# Altium schematic sheet ST_LINK_V3E.SchDoc: STLINK_V3E
size A3; Date: Not used; ApprovedBy: Not used; CheckedBy: Not used; Author: Not used; CompanyName: STMicroelectronics; DrawnBy: Not used; Engineer: Not used; Organization: Not used; Address1: Not used; Address2: Not used; Address3: Not used; Address4: Not used; DocumentNumber: 7; Revision: Not used; SheetNumber: 7; SheetTotal: 8; CurrentTime: Not used; CurrentDate: Not used; Time: Not used; DocumentFullPathAndName: Not used; DocumentName: Not used; ModifiedDate: Not used; ImagePath: Not used; ProjectName: Not used; Application_BuildNumber: Not used
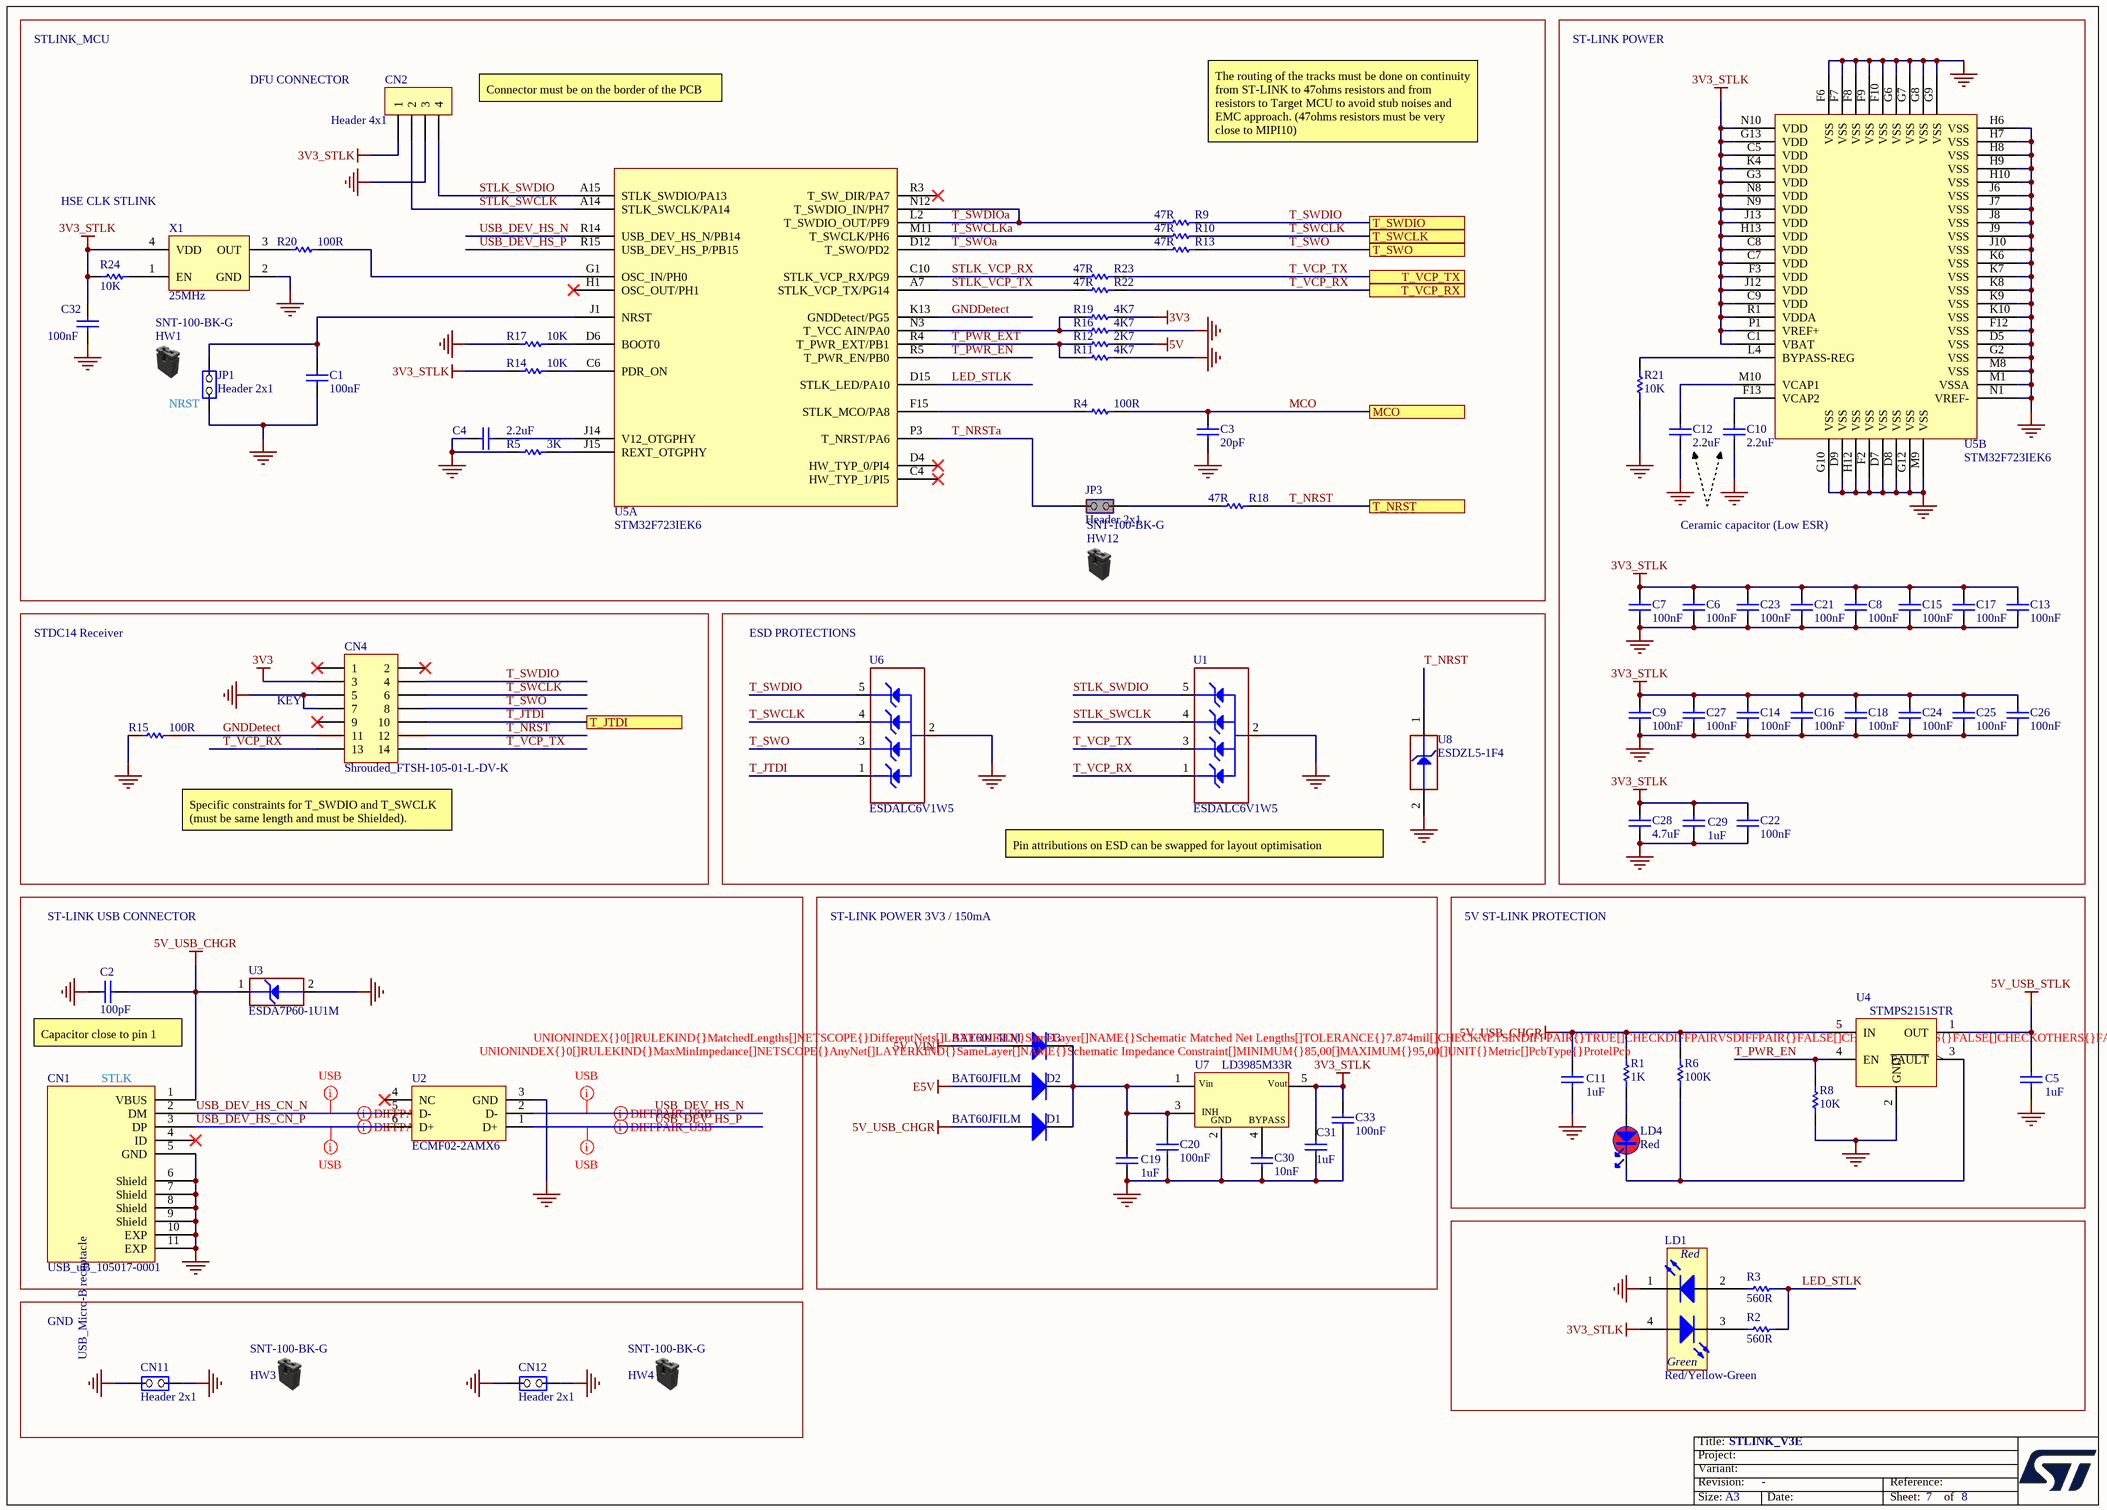
[diagram p0: ST_LINK_V3E.SchDoc]

## Parts
C1  value 100nF  [C0402]  (hidden comment: Capacitor)
C2  value 100pF  [C0402]
C3  value 20pF  [C0402]
C4  value 2.2uF  [C0603]
C5  value 1uF  [C0603]
C6  value 100nF  [C0402]  (hidden comment: Capacitor)
C7  value 100nF  [C0402]  (hidden comment: Capacitor)
C8  value 100nF  [C0402]  (hidden comment: Capacitor)
C9  value 100nF  [C0402]  (hidden comment: Capacitor)
C10  value 2.2uF  [C1206_H1P15]
C11  value 1uF  [C0603]
C12  value 2.2uF  [C1206_H1P15]
C13  value 100nF  [C0402]  (hidden comment: Capacitor)
C14  value 100nF  [C0402]  (hidden comment: Capacitor)
C15  value 100nF  [C0402]  (hidden comment: Capacitor)
C16  value 100nF  [C0402]  (hidden comment: Capacitor)
C17  value 100nF  [C0402]  (hidden comment: Capacitor)
C18  value 100nF  [C0402]  (hidden comment: Capacitor)
C19  value 1uF  [C0603]
C20  value 100nF  [C0402]  (hidden comment: Capacitor)
C21  value 100nF  [C0402]  (hidden comment: Capacitor)
C22  value 100nF  [C0402]  (hidden comment: Capacitor)
C23  value 100nF  [C0402]  (hidden comment: Capacitor)
C24  value 100nF  [C0402]  (hidden comment: Capacitor)
C25  value 100nF  [C0402]  (hidden comment: Capacitor)
C26  value 100nF  [C0402]  (hidden comment: Capacitor)
C27  value 100nF  [C0402]  (hidden comment: Capacitor)
C28  value 4.7uF  [C0603]
C29  value 1uF  [C0603]
C30  value 10nF  [C0402]
C31  value 1uF  [C0603]
C32  value 100nF  [C0402]  (hidden comment: Capacitor)
C33  value 100nF  [C0402]  (hidden comment: Capacitor)
CN1  value USB_uB_105017-0001  [CON_USBMICROB_MOLEX_105017-0001_H2P90]
CN2  value Header 4x1  [CON_SAMTEC_TSW-104-07-G-S]
CN4  value Shrouded_FTSH-105-01-L-DV-K  [CON_STDC14_Receiver_MEDIUM_WITH_MIPI10_3D]
CN11  value Header 2x1  [CON_SAMTEC_TSW-102-09-X-S]
CN12  value Header 2x1  [CON_SAMTEC_TSW-102-09-X-S]
D1  value BAT60JFILM  [DIO_SOD323]
D2  value BAT60JFILM  [DIO_SOD323]
D3  value BAT60JFILM  [DIO_SOD323]
HW1  value SNT-100-BK-G  (mechanical)
HW3  value SNT-100-BK-G  (mechanical)
HW4  value SNT-100-BK-G  (mechanical)
HW12  value SNT-100-BK-G  (mechanical)
JP1  value Header 2x1  [CON_SAMTEC_TSW-102-07-G-S]
JP3  value Header 2x1  [CON_SAMTEC_TSW-102-07-G-S]  (hidden comment: Shunt Fitted)
LD1  value Red/Yellow-Green  [LED_BI-GR_HSMF-A201-A00J1]  (hidden comment: LD_BICOLOR_CMS)
LD4  value Red  [LED_0603_VISHAY_VLMS1300-GS08_RED_1A2K_H0P8]  (hidden comment: LED_red)
R1  value 1K  [R0603]
R2  value 560R  [R0603]  (hidden comment: Resistor)
R3  value 560R  [R0603]  (hidden comment: Resistor)
R4  value 100R  [R0402]  (hidden comment: Resistor)
R5  value 3K  [R0402]
R6  value 100K  [R0603]
R8  value 10K  [R0603]
R9  value 47R  [R0402]
R10  value 47R  [R0402]
R11  value 4K7  [R0402]
R12  value 2K7  [R0402]
R13  value 47R  [R0402]
R14  value 10K  [R0402]
R15  value 100R  [R0402]  (hidden comment: Resistor)
R16  value 4K7  [R0402]
R17  value 10K  [R0402]
R18  value 47R  [R0402]
R19  value 4K7  [R0402]
R20  value 100R  [R0402]  (hidden comment: Resistor)
R21  value 10K  [R0402]
R22  value 47R  [R0402]
R23  value 47R  [R0402]
R24  value 10K  [R0402]
U1  value ESDALC6V1W5  [ESD_SOT323-5L]
U2  value ECMF02-2AMX6  [ESD_QFN-6L_1P7X1P5_P050]  (hidden comment: ​)
U3  value ESDA7P60-1U1M  [ESD_QFN2_1P6X1_P125]
U4  value STMPS2151STR  [MOS_SOT23-5L]
U5  value STM32F723IEK6  [ICC_UFBGA201_176+25_10X10_P065]  (parts A,B of 2)
U6  value ESDALC6V1W5  [ESD_SOT323-5L]
U7  value LD3985M33R  [REG_SOT23-5L]
U8  value ESDZL5-1F4  [ESD_0201_H0P3_1K_2A]  (hidden comment: ESD-TRANSIL)
X1  value 25MHz  [OSC_NDK_NZ2520SB_4P]

## Blocks framed on the sheet
ESD PROTECTIONS: U1 U6 U8
ST-LINK POWER 3V3 / 150mA: C19 C20 C30 C31 C33 D1-D3 U7
5V ST-LINK PROTECTION: C5 C11 LD4 R1 R6 R8 U4
GND: CN11 CN12 HW3 HW4

## Ports
MCO, T_JTDI, T_NRST, T_SWCLK, T_SWDIO, T_SWO, T_VCP_RX, T_VCP_TX

## Nets
3V3: CN4.3 R19.2
3V3_STLK: C6.2 C7.2 C8.2 C9.2 C13.2 C14.2 C15.2 C16.2 C17.2 C18.2 C21.2 C22.2 C23.2 C24.2 C25.2 C26.2 C27.2 C28.2 C29.2 C31.2 C32.2 C33.2 CN2.1 LD1.4(YellowGreen_anode) R14.1 R24.1 U5.C1(VBAT) U5.C5(VDD) U5.C7(VDD) U5.C8(VDD) U5.C9(VDD) U5.F3(VDD) U5.G3(VDD) U5.G13(VDD) U5.H13(VDD) U5.J12(VDD) U5.J13(VDD) U5.K4(VDD) U5.N8(VDD) U5.N9(VDD) U5.N10(VDD) U5.P1(VREF+) U5.R1(VDDA) U7.5(Vout) X1.4(VDD)
5V: R12.1
5V_USB_CHGR: C2.2 C11.2 CN1.1(VBUS) D1.1(A) R1.2 R6.2 U3.1(IO1) U4.5(IN)
5V_USB_STLK: C5.2 U4.1(OUT)
5V_VIN: D3.1(A)
E5V: D2.1(A)
GND: C1.1 C2.1 C3.1 C4.1 C5.1 C6.1 C7.1 C8.1 C9.1 C10.1 C11.1 C12.1 C13.1 C14.1 C15.1 C16.1 C17.1 C18.1 C19.1 C20.1 C21.1 C22.1 C23.1 C24.1 C25.1 C26.1 C27.1 C28.1 C29.1 C30.1 C31.1 C32.1 C33.1 CN1.5(GND) CN1.6(Shield) CN1.7(Shield) CN1.8(Shield) CN1.9(Shield) CN1.10(EXP) CN1.11(EXP) CN2.3 CN4.5 CN4.7 CN11.1(COMMON) CN11.2(NO) CN12.1(COMMON) CN12.2(NO) JP1.1(COMMON) LD1.1(RED_cathode) R5.1 R8.2 R11.1 R15.1 R16.2 R17.1 R21.1 U1.2(GND) U2.3(GND) U3.2(GND) U4.2(GND) U5.D5(VSS) U5.D7(VSS) U5.D8(VSS) U5.D9(VSS) U5.F2(VSS) U5.F6(VSS) U5.F7(VSS) U5.F8(VSS) U5.F9(VSS) U5.F10(VSS) U5.F12(VSS) U5.G2(VSS) U5.G6(VSS) U5.G7(VSS) U5.G8(VSS) U5.G9(VSS) U5.G10(VSS) U5.G12(VSS) U5.H6(VSS) U5.H7(VSS) U5.H8(VSS) U5.H9(VSS) U5.H10(VSS) U5.H12(VSS) U5.J6(VSS) U5.J7(VSS) U5.J8(VSS) U5.J9(VSS) U5.J10(VSS) U5.K6(VSS) U5.K7(VSS) U5.K8(VSS) U5.K9(VSS) U5.K10(VSS) U5.M1(VSSA) U5.M8(VSS) U5.M9(VSS) U5.N1(VREF-) U6.2(GND) U7.2(GND) U8.2(GND) X1.2(GND)
GNDDetect: CN4.11 R15.2 U5.K13(GNDDetect/PG5)
LED_STLK: R2.2 R3.2 U5.D15(STLK_LED/PA10)
MCO: C3.2 R4.2 ; port MCO
STLK_SWCLK: CN2.2 U1.4(IO3) U5.A14(STLK_SWCLK/PA14)
STLK_SWDIO: CN2.4 U1.5(IO4) U5.A15(STLK_SWDIO/PA13)
STLK_VCP_RX: R23.1 U5.C10(STLK_VCP_RX/PG9)
STLK_VCP_TX: R22.1 U5.A7(STLK_VCP_TX/PG14)
T_JTDI: CN4.10 U6.1(IO1) ; port T_JTDI
T_NRST: CN4.12 R18.2 U8.1(IO1) ; port T_NRST
T_NRSTa: JP3.1(COMMON) U5.P3(T_NRST/PA6)
T_PWR_EN: R8.1 U4.4(EN) U5.R5(T_PWR_EN/PB0)
T_PWR_EXT: R11.2 R12.2 U5.R4(T_PWR_EXT/PB1)
T_SWCLK: CN4.6 R10.2 U6.4(IO3) ; port T_SWCLK
T_SWCLKa: R10.1 U5.M11(T_SWCLK/PH6)
T_SWDIO: CN4.4 R9.2 U6.5(IO4) ; port T_SWDIO
T_SWDIOa: R9.1 U5.L2(T_SWDIO_OUT/PF9) U5.N12(T_SWDIO_IN/PH7)
T_SWO: CN4.8 R13.2 U6.3(IO2) ; port T_SWO
T_SWOa: R13.1 U5.D12(T_SWO/PD2)
T_VCP_RX: CN4.13 R22.2 U1.1(IO1) ; port T_VCP_RX
T_VCP_TX: CN4.14 R23.2 U1.3(IO2) ; port T_VCP_TX
USB_DEV_HS_CN_N: CN1.2(DM) U2.5(D-)
USB_DEV_HS_CN_P: CN1.3(DP) U2.6(D+)
USB_DEV_HS_N: U2.2(D-) U5.R14(USB_DEV_HS_N/PB14)
USB_DEV_HS_P: U2.1(D+) U5.R15(USB_DEV_HS_P/PB15)
NetC1_2: C1.2 JP1.2(NO) U5.J1(NRST)
NetC4_2: C4.2 U5.J14(V12_OTGPHY)
NetC10_2: C10.2 U5.F13(VCAP2)
NetC12_2: C12.2 U5.M10(VCAP1)
NetC19_2: C19.2 C20.2 D1.2(K) D2.2(K) D3.2(K) U7.1(Vin) U7.3(CE)
NetC30_2: C30.2 U7.4(BYPASS)
NetJP3_2: JP3.2(NO) R18.1
NetLD1_2: LD1.2(Red_anode) R3.1
NetLD1_3: LD1.3(YellowGreen_cathode) R2.1
NetLD4_1: LD4.1 R1.1
NetLD4_2: LD4.2 R6.1 U4.3(~{FAULT})
NetR4_1: R4.1 U5.F15(STLK_MCO/PA8)
NetR5_2: R5.2 U5.J15(REXT_OTGPHY)
NetR14_2: R14.2 U5.C6(PDR_ON)
NetR16_1: R16.1 R19.1 U5.N3(T_VCC_AIN/PA0)
NetR17_2: R17.2 U5.D6(BOOT0)
NetR20_1: R20.1 X1.3(OUT)
NetR20_2: R20.2 U5.G1(OSC_IN/PH0)
NetR21_2: R21.2 U5.L4(BYPASS-REG)
NetR24_2: R24.2 X1.1(EN)

Not connected (* = marked no-connect by the designer): CN1 4(ID)*; CN4 1* 2* 9*; U2 4(NC)*; U5 C4(HW_TYP_1/PI5)* D4(HW_TYP_0/PI4)* H1(OSC_OUT/PH1)* R3(T_SW_DIR/PA7)*

## Layout directives
differential pair; rule Impedance Constraint [Min = 85.00    Max = 95.00    ]: USB_DEV_HS_CN_N, USB_DEV_HS_CN_P, USB_DEV_HS_N, USB_DEV_HS_P
rule Undefined; rule Matched Net Lengths [Tolerance = 0.2mm]; rule Impedance Constraint [Min = 85.00    Max = 95.00    ]: USB_DEV_HS_CN_N, USB_DEV_HS_CN_P, USB_DEV_HS_N, USB_DEV_HS_P

## Notes on the sheet
- STLINK_MCU
- ST-LINK POWER
- DFU CONNECTOR
- (near CN2) Connector must be on the border of the PCB
- The routing of the tracks must be done on continuity from ST-LINK to 47ohms resistors and from resistors to Target MCU to avoid stub noises and EMC approach. (47ohms resistors must be very close to MIPI10)
- HSE CLK STLINK
- (near JP1) NRST
- Ceramic capacitor (Low ESR)
- STDC14 Receiver
- (near CN4) KEY
- Specific constraints for T_SWDIO and T_SWCLK (must be same length and must be Shielded).
- Pin attributions on ESD can be swapped for layout optimisation
- ST-LINK USB CONNECTOR
- (near C2) Capacitor close to pin 1
- (near CN1) STLK
- Title:
- Project:
- Size:
- Revision:
- Variant:
- A3
- -
- Date:
- Reference:
- Sheet:
- of
- (in symbol MCD-00028) USB_Micro-B receptacle
- (in symbol MCD-00086) INH
- (in symbol MCD-02402) Red; Green

## Library data of the parts
C1 C6-C9 C13-C18 C20-C27 C32 C33 = MCD-00006: Capacitor, MLCC, 100nF, 16V, X7R, +/-10%, 0402, T=0.5mm; Manufacturer_Part_Number: CC0402KRX7R7BB104; Manufacturer: YAGEO; Part_Preference: Recommended; Partial_Alternate_Internal_Part_Number: MCD-03299; Order_Code_RS: 9402047; Component_Country_Of_Origin: China; ShowFields: YES; ID: 2474; Internal_Part_Number: MCD-00006; Status: Released; Package: 0402; Part_Type: Capacitor; ComponentLink1URL: http://tunmcdsvn.tun.st.com/Component_Documentation_Library/Trunk/Capacitor/YAGEO_X7R_Series; Order_Code_Digikey: 311-1338-1-ND; Order_Code_Farnell: 9402047
C2 = MCD-00205: Capacitor, MLCC, 100pF, 50V, NPO, 5%, 0402, T=0,5mm; Manufacturer_Part_Number: CC0402JRNPO9BN101; Manufacturer: YAGEO; Part_Preference: Recommended; Provided_By: Subcon; Component_Country_Of_Origin: China; ID: 2658; ShowFields: YES; Internal_Part_Number: MCD-00205; Status: Released; Part_Type: Capacitor; Package: 0402; ComponentLink1Description: Yageo_Capacitor_NP0_16V-to-50V.pdf; ComponentLink1URL: http://tunmcdsvn.tun.st.com/Component_Documentation_Library/Trunk/Capacitor/YAGEO_NP0_Series; Order_Code_Digikey: 311-1024-1-ND; Order_Code_Farnell: 3019226RL; Order_Code_RS: N/A
C3 = MCD-00016: Capacitor, MLCC, 20pF, 50V, NPO, 5%, 0402, T=0,5mm; Manufacturer_Part_Number: CC0402JRNPO9BN200; Manufacturer: YAGEO; Part_Preference: Recommended; Provided_By: Subcon; Initial_Board_Reference: MB1274; Component_Country_Of_Origin: China; ID: 2479; ShowFields: YES; Internal_Part_Number: MCD-00016; Status: Released; Package: 0402; ComponentLink1Description: Yageo_Capacitor_NP0_16V-to-50V.pdf; ECCN_US: n/a; ECCN_EU: n/a; Part_Type: Capacitor; ComponentLink1URL: http://tunmcdsvn.tun.st.com/Component_Documentation_Library/Trunk/Capacitor/YAGEO_NP0_Series; Order_Code_Digikey: 311-1417-1-ND; Order_Code_Farnell: N/A; Order_Code_RS: N/A
C4 = MCD-00012: Capacitor, MLCC, 2.2uF, 10V, X5R, 10%, 0603, T=0,8mm; Manufacturer_Part_Number: CC0603KRX5R6BB225; Manufacturer: YAGEO; Alternate_Manufacturer_Part_Number: C0603C225K8PACTU; Alternate_Manufacturer: KEMET; BMS_Part_Number: 9142010; Part_Preference: Recommended; Partial_Alternate_Internal_Part_Number: MCD-00551; Provided_By: Subcon; Initial_Board_Reference: MB1274; Component_Country_Of_Origin: China; ID: 2467; Order_Code_RS: 2370679; ShowFields: YES; Internal_Part_Number: MCD-00012; Status: Released; Package: 0603; ComponentLink1Description: Yageo_Capacitor_X5R-series.pdf; ECCN_US: n/a; ECCN_EU: n/a; Part_Type: Capacitor; ComponentLink1URL: http://tunmcdsvn.tun.st.com/Component_Documentation_Library/Trunk/Capacitor/YAGEO_X5R_Series; Order_Code_Digikey: 311-1451-1-ND; Order_Code_Farnell: 2370679
C5 C11 C19 C29 C31 = MCD-00010: Capacitor, MLCC, 1uF, 16V, X5R, 10%, 0603, T=0,8mm; Manufacturer_Part_Number: CC0603KRX5R7BB105; Manufacturer: YAGEO; Part_Preference: Recommended; Provided_By: Subcon; Initial_Board_Reference: MB1274; Component_Country_Of_Origin: China; ID: 2470; Order_Code_RS: 2370680; ShowFields: YES; Internal_Part_Number: MCD-00010; Status: Released; Package: 0603; ComponentLink1Description: Yageo_Capacitor_X5R-series.pdf; ECCN_US: n/a; ECCN_EU: n/a; Part_Type: Capacitor; ComponentLink1URL: http://tunmcdsvn.tun.st.com/Component_Documentation_Library/Trunk/Capacitor/YAGEO_X5R_Series; Order_Code_Digikey: 311-1444-1-ND; Order_Code_Farnell: 2370680
C10 C12 = MCD-00008: Capacitor, MLCC, 2.2uF, 16V, X7R, 10%, 1206, T=1,15mm; Manufacturer_Part_Number: CC1206KKX7R7BB225; Manufacturer: YAGEO; Alternate_Manufacturer_Part_Number: C1206C225K4RAC; Alternate_Manufacturer: KEMET; Part_Preference: Recommended; Provided_By: Subcon; Initial_Board_Reference: MB1274; Component_Country_Of_Origin: China; ID: 2472; ShowFields: YES; Internal_Part_Number: MCD-00008; Status: Released; Package: 1206; ComponentLink1Description: Yageo_Capacitor_X7R-series.pdf; ECCN_US: n/a; ECCN_EU: n/a; Part_Type: Capacitor; ComponentLink1URL: http://tunmcdsvn.tun.st.com/Component_Documentation_Library/Trunk/Capacitor/YAGEO_X7R_Series; Order_Code_Digikey: 311-1957-1-ND; Order_Code_Farnell: N/A; Order_Code_RS: N/A
C28 = MCD-00009: Capacitor, MLCC, 4.7uF, 16V, X5R, 10%, 0603, T=0.8mm; Manufacturer_Part_Number: CC0603KRX5R7BB475; Manufacturer: YAGEO; Part_Preference: Recommended; Partial_Alternate_Internal_Part_Number: MCD-03565; Provided_By: subcon; Initial_Board_Reference: MB1274; Alternate_EMS: A; Component_Country_Of_Origin: China; ID: 2471; ShowFields: YES; Internal_Part_Number: MCD-00009; Status: Released; Part_Type: Capacitor; Package: 0603; ComponentLink1Description: Yageo_Capacitor_X5R-series.pdf; ECCN_US: n/a; ECCN_EU: n/a; ComponentLink1URL: http://tunmcdsvn.tun.st.com/Component_Documentation_Library/Trunk/Capacitor/YAGEO_X5R_Series; Order_Code_Digikey: 311-1785-1-ND; Order_Code_Farnell: N/A; Order_Code_RS: N/A
C30 = MCD-00011: Capacitor, MLCC, 10nF, 16V, X7R, 10%, 0402, T=0.5mm; Manufacturer_Part_Number: CC0402KRX7R7BB103; Manufacturer: YAGEO; Part_Preference: Recommended; Provided_By: Subcon; Initial_Board_Reference: MB1274; Component_Country_Of_Origin: China; ID: 2469; Order_Code_RS: 3019275; ShowFields: YES; Internal_Part_Number: MCD-00011; Status: Released; Part_Type: Capacitor; Package: 0402; ComponentLink1Description: Yageo_Capacitor_X7R-series.pdf; ECCN_US: n/a; ECCN_EU: n/a; ComponentLink1URL: http://tunmcdsvn.tun.st.com/Component_Documentation_Library/Trunk/Capacitor/YAGEO_X7R_Series; Order_Code_Digikey: 311-1042-1-ND; Order_Code_Farnell: 3019275
CN1 = MCD-00028: USB-MICRO-B, 0.65mm, RA, SMT, Bottom Mount,; Manufacturer_Part_Number: 1050170001; Manufacturer: MOLEX; Part_Type: Connector; Part_Preference: Recommended; Partial_Alternate_Internal_Part_Number: MCD-04277; Provided_By: Subcon; Initial_Board_Reference: MB1274; Component_Country_Of_Origin: Unknown; ID: 2489; Order_Code_RS: 2293836; ShowFields: YES; Internal_Part_Number: MCD-00028; Status: Released; ComponentLink1Description: Molex_Connector-USB-microB_105017-0001.pdf; ECCN_US: n/a; ECCN_EU: n/a; ComponentLink1URL: http://tunmcdsvn.tun.st.com/Component_Documentation_Library/Trunk/Connector/MOLEX_1050170001; Order_Code_Digikey: WM1399TR-ND; Order_Code_Farnell: 2293836
CN2 = MCD-00029: Header, 4x1, 2,54mm, VR, TH, Height 5.84mm/2.54mm; Manufacturer_Part_Number: TSW-104-07-G-S; Manufacturer: SAMTEC; Part_Type: Connector; Part_Preference: Recommended; Partial_Alternate_Internal_Part_Number: MCD-04227; Provided_By: Subcon; Initial_Board_Reference: MB1274; Component_Country_Of_Origin: United States°; ID: 2487; Order_Code_RS: 161-2460; ShowFields: YES; Internal_Part_Number: MCD-00029; Status: Released; ComponentLink1Description: Samtec_connector_TSW-HTSW-series.pdf; ECCN_US: n/a; ECCN_EU: n/a; ComponentLink1URL: http://tunmcdsvn.tun.st.com/Component_Documentation_Library/Trunk/Connector/SAMTEC_TSW_Series; Order_Code_Digikey: TSW-104-07-G-S-ND; Order_Code_Farnell: 2667450
CN4 = MCD-01226: Header 5x2, 1.27mm, Dual row, Straight, Surface mount, vertical male connector. 3.05mm lead. Mates with FFSD connector. Footprint compatible with FTSH-107-01-L-DV,-K,-A,-P,-ES (STDC14 MEDIUM); Manufacturer_Part_Number: FTSH-105-01-L-DV-K; Manufacturer: SAMTEC; Alternate_Manufacturer_Part_Number: P127B-2x05MGF-079-0A; Alternate_Manufacturer: JIUBABA; Part_Preference: Recommended; Partial_Alternate_Internal_Part_Number: MCD-02956, MCD-03742, MCD-03788, MCD-03996, MCD-04591; Provided_By: SUBCO; Component_Country_Of_Origin: China, Costa Rica, Malaysia, USA, Vietnam; ID: 3265; Order_Code_RS: 159-2332; ShowFields: YES; Internal_Part_Number: MCD-01226; Status: Released; Part_Type: Connector; ComponentLink1Description: Datasheet; ComponentLink1URL: http://tunmcdsvn.tun.st.com/Component_Documentation_Library/Trunk/Connector/SAMTEC_FTSH_Series; ECCN_US: n/a; ECCN_EU: n/a; Order_Code_Digikey: SAM8799-ND; Order_Code_Farnell: 2856879
CN11 CN12 = MCD-00214: Header, 2x1, 2,54mm, VR, TH, Height 5.84mm/10.16mm; Part_Type: Connector; Manufacturer_Part_Number: TSW-102-09-G-S; Manufacturer: SAMTEC; Part_Preference: Recommended; Partial_Alternate_Internal_Part_Number: MCD-02393, MCD-03591, MCD-03719, MCD-03986, MCD-03999, MCD-04227; Provided_By: Subcon; Initial_Board_Reference: MB1319; Component_Country_Of_Origin: China, Costa Rica, Malaysia, USA, Vietnam; ID: 2652; Order_Code_RS: 180-3129; ShowFields: YES; Internal_Part_Number: MCD-00214; Status: Released; ComponentLink1Description: Samtec_connector_TSW-HTSW-series.pdf; ComponentLink1URL: http://tunmcdsvn.tun.st.com/Component_Documentation_Library/Trunk/Connector/SAMTEC_TSW_Series/; ECCN_US: n/a; ECCN_EU: n/a; Order_Code_Digikey: SAM10845-ND; Order_Code_Farnell: 3663349
D1-D3 = MCD-00034: BAT60JFILM; Manufacturer: STMICROELECTRONICS; Part_Type: Diode; BMS_Part_Number: 9151097; Manufacturer_HQ_COO: EU; Part_Preference: Recommended; ECCN_US: EAR99; ECCN_EU: NEC; Provided_By: Subcon; Initial_Board_Reference: MB1274; Component_Country_Of_Origin: China; ID: 2483; Order_Code_RS: 714-6879; ShowFields: YES; Internal_Part_Number: MCD-00034; Manufacturer_Part_Number: BAT60JFILM; ComponentLink1Description: STM_Diode_BAT60JFILM-SOD323.pdf; Status: Released; ComponentLink1URL: http://tunmcdsvn.tun.st.com/Component_Documentation_Library/Trunk/Diode/STMICROELECTRONICS_BAT60J_Series; Order_Code_Digikey: 497-3707-2-ND; Order_Code_Farnell: 1467544; Package: SOD-323
HW1 HW3 HW4 HW12 = MCD-00043: SHUNT 2.54mm BLACK; Manufacturer: SAMTEC; Part_Type: Misc; Manufacturer_HQ_COO: Unknown; Part_Preference: Recommended; Partial_Alternate_Internal_Part_Number: MCD-01849, MCD-01864, MCD-02388, MCD-03991, MCD-04284, MCD-04580; Provided_By: Subcon; Initial_Board_Reference: MB1274; Alternate_EMS: A; Component_Country_Of_Origin: China, Costa Rica, Malaysia, USA, Vietnam; ID: 2551; Order_Code_RS: 158-7784; ShowFields: YES; Internal_Part_Number: MCD-00043; ECCN_US: n/a; ECCN_EU: n/a; Manufacturer_Part_Number: SNT-100-BK-G; ComponentLink1Description: Samtec_Shunt_Jumper_SNT100.pdf; Status: Released; ComponentLink1URL: http://tunmcdsvn.tun.st.com/Component_Documentation_Library/Trunk/Misc/SAMTEC_SNT-100-BK-G; Order_Code_Digikey: SAM8858-ND; Order_Code_Farnell: 2505007; Package: 2.54x5.08mm
JP1 = MCD-00045: Header, 2x1, 2,54mm, VR, TH, Height 5.84mm/2.54mm; Part_Type: Connector; Manufacturer_Part_Number: TSW-102-07-G-S; Manufacturer: SAMTEC; Part_Preference: Recommended; Partial_Alternate_Internal_Part_Number: MCD-02389, MCD-02957, MCD-03720, MCD-03979, MCD-04249; Provided_By: Subcon; Initial_Board_Reference: MB1274; Component_Country_Of_Origin: China, Costa Rica, Malaysia, USA, Vietnam; ID: 2545; Order_Code_RS: 2505044; ShowFields: YES; Internal_Part_Number: MCD-00045; Status: Released; ComponentLink1Description: Samtec_connector_TSW-HTSW-series.pdf; ComponentLink1URL: http://tunmcdsvn.tun.st.com/Component_Documentation_Library/Trunk/Connector/SAMTEC_TSW_Series; ECCN_US: n/a; ECCN_EU: n/a; Order_Code_Digikey: SAM1029-02-ND; Order_Code_Farnell: 2505044
JP3 = MCD-00683: Header, 2x1, 2,54mm, VR, TH, Height 5.84mm/2.54mm - Shunt Fitted by default; Part_Type: Connector; Manufacturer_Part_Number: TSW-102-07-G-S; Manufacturer: SAMTEC; Part_Preference: Recommended; Partial_Alternate_Internal_Part_Number: MCD-02389, MCD-02957, MCD-03720, MCD-03979, MCD-04463; Provided_By: Subcon; Initial_Board_Reference: MB1331; Component_Country_Of_Origin: China, Costa Rica, Malaysia, USA, Vietnam; ID: 3057; Order_Code_RS: 155-5312; ShowFields: YES; Internal_Part_Number: MCD-00683; Status: Released; ComponentLink1Description: Samtec_connector_TSW-HTSW-series.pdf; ComponentLink1URL: http://tunmcdsvn.tun.st.com/Component_Documentation_Library/Trunk/Connector/SAMTEC_TSW_Series; ECCN_US: n/a; ECCN_EU: n/a; Order_Code_Digikey: SAM1029-02-ND; Order_Code_Farnell: 2505044
LD1 = MCD-02402: LED Bicolor; Part_Type: Display; Part_Preference: Not recommended; Manufacturer: EVERLIGHT; Manufacturer_Part_Number: 67-22SURSYGC/S530-A2/TR8; Alternate_Internal_Part_Number: MCD-00051; Full_Alternate_Internal_Part_Number: MCD-00051, MCD-02631; ShowFields: YES; ID: 4508; Internal_Part_Number: MCD-02402; Status: Released; ComponentLink1URL: http://tunmcdsvn.tun.st.com/Component_Documentation_Library/Trunk/Display/EVERLIGHT_67-22sursygc-s530-a2-tr8; Order_Code_Digikey: 1080-67-22SURSYGC/S530-A2/TR8TR-ND; Order_Code_Farnell: N/A; Order_Code_RS: N/A; Package: 4-PLCC
LD4 = MCD-02787: LED, Red, 1V7 to 2V2, 5mA, 0603; Part_Type: Display; Part_Preference: Recommended; Manufacturer: EVERLIGHT; Manufacturer_Part_Number: 19-217/R6C-AL1M2VY/6T; Full_Alternate_Internal_Part_Number: MCD-02401; Partial_Alternate_Internal_Part_Number: MCD-00586; ShowFields: YES; ID: 4899; Component_Country_Of_Origin: China; Internal_Part_Number: MCD-02787; Status: Released; Package: 0603; ComponentLink1URL: http://tunmcdsvn.tun.st.com/Component_Documentation_Library/Trunk/Display/EVERLIGHT_19-217-R6C-AL1M2VY-6T; Order_Code_Digikey: 1080-19-217/R6C-AL1M2VY/6TTR-ND; Order_Code_Farnell: N/A; Order_Code_RS: N/A
R1 = MCD-00070: Resistor,1K,0603,1%,1/10W; Manufacturer_Part_Number: RC0603FR-071KL; Manufacturer: YAGEO; Part_Preference: Recommended; Provided_By: Subcon; Initial_Board_Reference: MB1274; Component_Country_Of_Origin: China; ID: 2522; Order_Code_RS: 9238484RL; ShowFields: YES; Internal_Part_Number: MCD-00070; ECCN_US: n/a; ECCN_EU: n/a; ComponentLink1Description: Yageo_Resistor_RC0603-series.pdf; Status: Released; Part_Type: Resistor; Package: 0603; ComponentLink1URL: http://tunmcdsvn.tun.st.com/Component_Documentation_Library/Trunk/Resistor/YAGEO_RC_L_Series; Order_Code_Digikey: 311-1.00KHRCT-ND; Order_Code_Farnell: 9238484RL
R2 R3 = MCD-00490: Resistor, 560R, 0603, +/-1%, 1/10W; Manufacturer_Part_Number: RC0603FR-07560RL; Manufacturer: YAGEO; BMS_Part_Number: 9129742; Part_Preference: Recommended; Component_Country_Of_Origin: China; ID: 2787; ShowFields: YES; Internal_Part_Number: MCD-00490; Status: Released; Part_Type: Resistor; Package: 0603; ComponentLink1URL: http://tunmcdsvn.tun.st.com/Component_Documentation_Library/Trunk/Resistor/YAGEO_RC_L_Series; Order_Code_Digikey: 311-560HRCT-ND; Order_Code_Farnell: 9238450; Order_Code_RS: N/A
R4 R15 R20 = MCD-00067: Resistor, 100R, 0402, +/- 1%, 1/16W; Manufacturer_Part_Number: RC0402FR-07100RL; Manufacturer: YAGEO; Part_Preference: Recommended; Order_Code_RS: 9239111; Component_Country_Of_Origin: China; ShowFields: YES; ID: 2527; Internal_Part_Number: MCD-00067; Status: Released; Part_Type: Resistor; Package: 0402; ComponentLink1URL: http://tunmcdsvn.tun.st.com/Component_Documentation_Library/Trunk/Resistor/YAGEO_RC_L_Series; Order_Code_Digikey: 311-100LRCT-ND; Order_Code_Farnell: 9239111
R5 = MCD-00185: Resistor,3K,0402,1%,1/16W; Manufacturer_Part_Number: RC0402FR-073KL; Manufacturer: YAGEO; Part_Preference: Recommended; Provided_By: Subcon; Component_Country_Of_Origin: China; ID: 2682; ShowFields: YES; Internal_Part_Number: MCD-00185; Status: Released; ComponentLink1Description: Yageo_Resistor_RC0402-series.pdf; ECCN_US: n/a; ECCN_EU: n/a; Part_Type: Resistor; Package: 0402; ComponentLink1URL: http://tunmcdsvn.tun.st.com/Component_Documentation_Library/Trunk/Resistor/YAGEO_RC_L_Series; Order_Code_Digikey: 311-3KLRCT-ND; Order_Code_Farnell: 1458777; Order_Code_RS: N/A
R6 = MCD-00223: Resistor,100K,0603,1%,1/10W; Manufacturer_Part_Number: RC0603FR-07100KL; Manufacturer: YAGEO; Part_Preference: Recommended; Provided_By: Subcon; Initial_Board_Reference: MB1319; Component_Country_Of_Origin: China; ID: 2647; ShowFields: YES; Internal_Part_Number: MCD-00223; Status: Released; Part_Type: Resistor; Package: 0603; ComponentLink1Description: Yageo_Resistor_RC0603-series.pdf; ComponentLink1URL: http://tunmcdsvn.tun.st.com/Component_Documentation_Library/Trunk/Resistor/YAGEO_RC_L_Series; ECCN_US: n/a; ECCN_EU: n/a; Order_Code_Digikey: 311-100KHRTR-ND; Order_Code_Farnell: 2421851; Order_Code_RS: N/A
R8 = MCD-00220: Resistor,10K,0603,1%,1/10W; Manufacturer_Part_Number: RC0603FR-0710KL; Manufacturer: YAGEO; Part_Preference: Recommended; Provided_By: Subcon; Initial_Board_Reference: MB1319; Component_Country_Of_Origin: China; ID: 2649; ShowFields: YES; Internal_Part_Number: MCD-00220; ECCN_US: n/a; ECCN_EU: n/a; ComponentLink1Description: Yageo_Resistor_RC0603-series.pdf; Status: Released; Part_Type: Resistor; Package: 0603; ComponentLink1URL: http://tunmcdsvn.tun.st.com/Component_Documentation_Library/Trunk/Resistor/YAGEO_RC_L_Series; Order_Code_Digikey: 311-10.0KHRCT-ND; Order_Code_Farnell: 9238603; Order_Code_RS: N/A
R9 R10 R13 R18 R22 R23 = MCD-00481: Resistor,47R,0402,1%,1/16W; Manufacturer_Part_Number: RC0402FR-0747RL; Manufacturer: YAGEO; Part_Preference: Recommended; Provided_By: SUBCO; ECCN_US: EAR99; ECCN_EU: NEC; Component_Country_Of_Origin: China; ID: 2796; ShowFields: YES; Internal_Part_Number: MCD-00481; Status: Released; Part_Type: Resistor; Package: 0402; ComponentLink1Description: Datasheet; ComponentLink1URL: http://tunmcdsvn.tun.st.com/Component_Documentation_Library/Trunk/Resistor/YAGEO_RC_L_Series; Order_Code_Digikey: 311-47.0LRCT-ND; Order_Code_Farnell: 9239073; Order_Code_RS: N/A
R11 R16 R19 = MCD-00065: Resistor,4K7,0402,1%,1/16W; Manufacturer_Part_Number: RC0402FR-074K7L; Manufacturer: YAGEO; Alternate_Manufacturer_Part_Number: RT0402FRE074K7L; Part_Preference: Recommended; Partial_Alternate_Internal_Part_Number: MCD-03300; Provided_By: Subcon; Initial_Board_Reference: MB1274; Component_Country_Of_Origin: China; ID: 2526; Order_Code_RS: 9239316; ShowFields: YES; Internal_Part_Number: MCD-00065; Status: Released; ComponentLink1Description: Yageo_Resistor_RC0402-series.pdf; ECCN_US: n/a; ECCN_EU: n/a; Alternate_Manufacturer: YAGEO; Part_Type: Resistor; Package: 0402; ComponentLink1URL: http://tunmcdsvn.tun.st.com/Component_Documentation_Library/Trunk/Resistor/YAGEO_RC_L_Series; Order_Code_Digikey: 311-4.7KLRCT-ND; Order_Code_Farnell: 9239316
R12 = MCD-00055: Resistor,2K7,0402,1%,1/16W; Manufacturer_Part_Number: RC0402FR-072K7L; Manufacturer: YAGEO; Part_Preference: Recommended; Provided_By: Subcon; Initial_Board_Reference: MB1274; Component_Country_Of_Origin: China; ID: 2535; Order_Code_RS: 9239286; ShowFields: YES; Internal_Part_Number: MCD-00055; Status: Released; ComponentLink1Description: Yageo_Resistor_RC0402-series.pdf; ECCN_US: n/a; ECCN_EU: n/a; Part_Type: Resistor; Package: 0402; ComponentLink1URL: http://tunmcdsvn.tun.st.com/Component_Documentation_Library/Trunk/Resistor/YAGEO_RC_L_Series; Order_Code_Digikey: 311-2.70KLRCT-ND; Order_Code_Farnell: 9239286
R14 R17 R21 R24 = MCD-00053: Resistor,10K,0402,1%,1/16W; Manufacturer_Part_Number: RC0402FR-0710KL; Manufacturer: YAGEO; BMS_Part_Number: 9131590; Part_Preference: Recommended; Provided_By: subcon; Initial_Board_Reference: MB1274; Component_Country_Of_Origin: China; ID: 2539; Order_Code_RS: 9239359; ShowFields: YES; Internal_Part_Number: MCD-00053; Status: Released; ComponentLink1Description: Yageo_Resistor_RC0402-series.pdf; ECCN_US: n/a; ECCN_EU: n/a; Part_Type: Resistor; Package: 0402; ComponentLink1URL: http://tunmcdsvn.tun.st.com/Component_Documentation_Library/Trunk/Resistor/YAGEO_RC_L_Series; Order_Code_Digikey: 311-10.0KLRCT-ND; Order_Code_Farnell: 9239359
U1 U6 = MCD-00136: Dual Transil array for ESD protection; Part_Type: Diode; Manufacturer: STMICROELECTRONICS; BMS_Part_Number: 9151112; Manufacturer_HQ_COO: EU; Part_Preference: Recommended; ECCN_US: EAR99; ECCN_EU: NEC; Provided_By: Subcon; Initial_Board_Reference: MB1262; Component_Country_Of_Origin: China; ID: 2731; Order_Code_RS: 178-7373; ShowFields: YES; Internal_Part_Number: MCD-00136; Status: Released; Manufacturer_Part_Number: ESDALC6V1W5; ComponentLink1Description: STM_ESD_ESDALC6V1W5.pdf; ComponentLink1URL: http://tunmcdsvn.tun.st.com/Component_Documentation_Library/Trunk/Diode/STMICROELECTRONICS_ESDALC6V1W5; Order_Code_Digikey: 497-7231-2-ND; Order_Code_Farnell: 2252381; Package: SOT323-5
U2 = MCD-00649: Common mode filter with ESD protection for USB 2.0 interface; Part_Type: Diode; Manufacturer: STMICROELECTRONICS; BMS_Part_Number: 9151138; Manufacturer_HQ_COO: EU; Part_Preference: Recommended; ECCN_US: EAR99; ECCN_EU: NEC; Provided_By: Subcon; Initial_Board_Reference: MB1248; Component_Country_Of_Origin: China; ID: 3094; Order_Code_RS: 880-5276; ShowFields: YES; Internal_Part_Number: MCD-00649; Status: Released; Manufacturer_Part_Number: ECMF02-2AMX6; ComponentLink1Description: STM_ESD_ECMF02-2AMX6.pdf; ComponentLink1URL: http://tunmcdsvn.tun.st.com/Component_Documentation_Library/Trunk/Diode/STMICROELECTRONICS_ECMF02-2AMX6; Order_Code_Digikey: 497-10773-2-ND; Order_Code_Farnell: 2629720; Package: QFN-6
U3 = MCD-00251: High power transient voltage suppressor, 7V breakdown; Part_Type: Diode; Manufacturer: STMICROELECTRONICS; BMS_Part_Number: 9179042; Manufacturer_HQ_COO: EU; Part_Preference: Recommended; ECCN_US: EAR99; ECCN_EU: NEC; Provided_By: Subcon; Initial_Board_Reference: MB1311; Component_Country_Of_Origin: China; ID: 2618; Order_Code_RS: 110-6381; ShowFields: YES; Internal_Part_Number: MCD-00251; Status: Released; Manufacturer_Part_Number: ESDA7P60-1U1M; ComponentLink1Description: STM_ESD_ESDA7P60-1U1M.pdf; ComponentLink1URL: http://tunmcdsvn.tun.st.com/Component_Documentation_Library/Trunk/Diode/STMICROELECTRONICS_ESDA7P60-1U1M; Order_Code_Digikey: 497-16253-2-ND; Order_Code_Farnell: N/A; Package: QFN1610
U4 = MCD-00159: 500mA, Enhanced single channel power switches with active high enable pin; Part_Type: IC; Manufacturer: STMICROELECTRONICS; Alternate_Manufacturer_Part_Number: TPS2051C; Alternate_Manufacturer: TEXAS INSTRUMENTS; BMS_Part_Number: 9159009; Part_Preference: Recommended; ECCN_US: EAR99; ECCN_EU: NEC; Provided_By: Subcon; Initial_Board_Reference: MB1264; Component_Country_Of_Origin: Malaysia; ID: 2708; Order_Code_RS: 165-5516; ShowFields: YES; Internal_Part_Number: MCD-00159; Status: Released; Manufacturer_Part_Number: STMPS2151STR; ComponentLink1Description: STM_PWR-Switch_STMPS2151STR.pdf; ComponentLink1URL: http://tunmcdsvn.tun.st.com/Component_Documentation_Library/Trunk/IC/STMICROELECTRONICS_STMPS2151STR; Order_Code_Digikey: 497-6934-2-ND; Order_Code_Farnell: 1842616; Package: SOT23-5
U5 = MCD-00596: STM32F723IEK  (STM32F7) BGA176; Part_Type: IC; Manufacturer: STMICROELECTRONICS; BMS_Part_Number: 9175300; Manufacturer_HQ_COO: EU; Part_Preference: Not recommended; Provided_By: SUBCO with ST control; ECCN_US: 3A991A2; ECCN_EU: NEC; Component_Country_Of_Origin: Philippines; ID: 3144; Order_Code_RS: 135-8241; ShowFields: YES; Internal_Part_Number: MCD-00596; Status: Released; Manufacturer_Part_Number: STM32F723IEK6; ComponentLink1Description: Datasheet; ComponentLink1URL: http://tunmcdsvn.tun.st.com/Component_Documentation_Library/Trunk/IC/STMICROELECTRONICS_STM32F723IEK6; Order_Code_Digikey: 497-17186-ND; Order_Code_Farnell: 2725149; Package: UFBGA201
U7 = MCD-00086: Ultra low drop-low noise BiCMOS voltage, regulators low ESR capacitors compatible; Manufacturer: STMICROELECTRONICS; Part_Type: IC; BMS_Part_Number: 9176161; Manufacturer_HQ_COO: EU; Part_Preference: Recommended; ECCN_US: EAR99; ECCN_EU: NEC; Provided_By: Subcon; Initial_Board_Reference: MB1274; Component_Country_Of_Origin: China; ID: 2506; Order_Code_RS: 168-6500; ShowFields: YES; Internal_Part_Number: MCD-00086; Status: Released; Manufacturer_Part_Number: LD3985M33R; ComponentLink1Description: STM_LDO_LD3985.pdf; ComponentLink1URL: http://tunmcdsvn.tun.st.com/Component_Documentation_Library/Trunk/IC/STMICROELECTRONICS_LD3985M33R; Order_Code_Digikey: 497-3504-2-ND; Order_Code_Farnell: 1250121; Package: SOT23-5
U8 = MCD-03501: Diode, ESD TVS, 5V5, 100nA, 10V, 0201; Manufacturer: STMICROELECTRONICS; Part_Preference: Recommended; Component_Country_Of_Origin: Singapore; ID: 5617; ShowFields: YES; Internal_Part_Number: MCD-03501; Status: Released; Part_Type: Diode; Manufacturer_Part_Number: ESDZL5-1F4; ComponentLink1URL: http://tunmcdsvn.tun.st.com/Component_Documentation_Library/Trunk/Diode/STMICROELECTRONICS_ESDZL5-1F4; Order_Code_Digikey: 497-17544-2-ND; Order_Code_Farnell: ESDZL5-1F4; Order_Code_RS: ESDZL5-1F4; Package: 0201
X1 = MCD-00597: Oscillator 25.00Mhz, -+50PPM, 3.3V, Temp -55 to +125°C; Manufacturer_Part_Number: NZ2520SH-25MHz-END4869C; Manufacturer: NDK; Alternate_Manufacturer_Part_Number: KC2520B25.0000C10E00; Alternate_Manufacturer: AVX CORP/KYOCERA CORP; Part_Type: Crystal_Osc; BMS_Part_Number: 9157050; Part_Preference: Recommended; Provided_By: STM; Initial_Board_Reference: MB1331; Component_Country_Of_Origin: Japan; ID: 3148; ShowFields: YES; Internal_Part_Number: MCD-00597; Status: Released; ComponentLink1Description: NDK_OSCILLATOR_NZ2520SB.pdf; ComponentLink1URL: http://tunmcdsvn.tun.st.com/Component_Documentation_Library/Trunk/Crystal_Oscillator/NDK_NZ2520SH_Series; Order_Code_Digikey: N/A; ECCN_US: n/a; ECCN_EU: n/a; Order_Code_Farnell: N/A; Order_Code_RS: N/A; Package: 2.5x2.0mm